# EAGLE design usb_board (EAGLE 9.6.2)
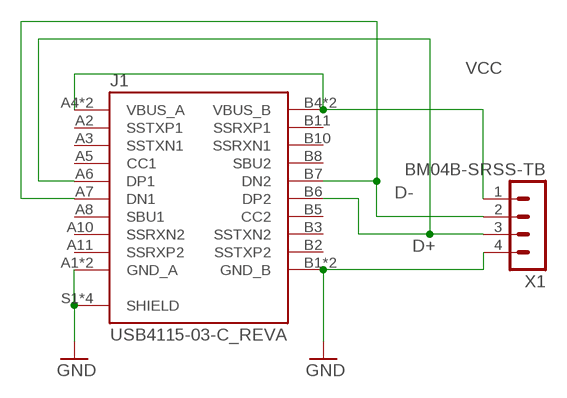
[diagram p0: schematic, sheet 1]

## Parts
J1  USB4115-03-C_REVA  [GCT_USB4115-03-C_REVA]
X1  BM04B-SRSS-TB  [BM04B-SRSS-TB]

## Nets
D+: J1.A6(DP1) J1.B6(DP2) X1.3
D-: J1.A7(DN1) J1.B7(DN2) X1.2
GND: J1.A1(GND_A) J1.A12(GND_A) J1.B1(GND_B) J1.B12(GND_B) J1.S1(SHIELD) J1.S2(SHIELD) J1.S3(SHIELD) J1.S4(SHIELD) X1.4
VCC: J1.A4(VBUS_A) J1.A9(VBUS_A) J1.B4(VBUS_B) J1.B9(VBUS_B) X1.1
Unconnected: J1.A2(SSTXP1) J1.A3(SSTXN1) J1.A5(CC1) J1.A8(SBU1) J1.A10(SSRXN2) J1.A11(SSRXP2) J1.B2(SSTXP2) J1.B3(SSTXN2) J1.B5(CC2) J1.B8(SBU2) J1.B10(SSRXN1) J1.B11(SSRXP1)

## Library data of the parts
J1 = USB4115-03-C_REVA:USB4115-03-C_REVA: Check prices <https://pricing.snapeda.com/parts/USB4115-03-C/Global%20Connector%20Technology/view-part?ref=eda>; AVAILABILITY: In Stock; DESCRIPTION: USB 3.1 Connector Type C Vertical Receptacle, 9.25mm profile, 24 Pins, Surface mount, Top mount, low cost; MF: Global Connector Technology; MP: USB4115-03-C; PACKAGE: None; PRICE: None
X1 = con-JST SH:BM04B-SRSS: JST SH series header 1.00mm pitch disconnectable crimp style connectors, vertical (side entry type), 4 pins

## Board
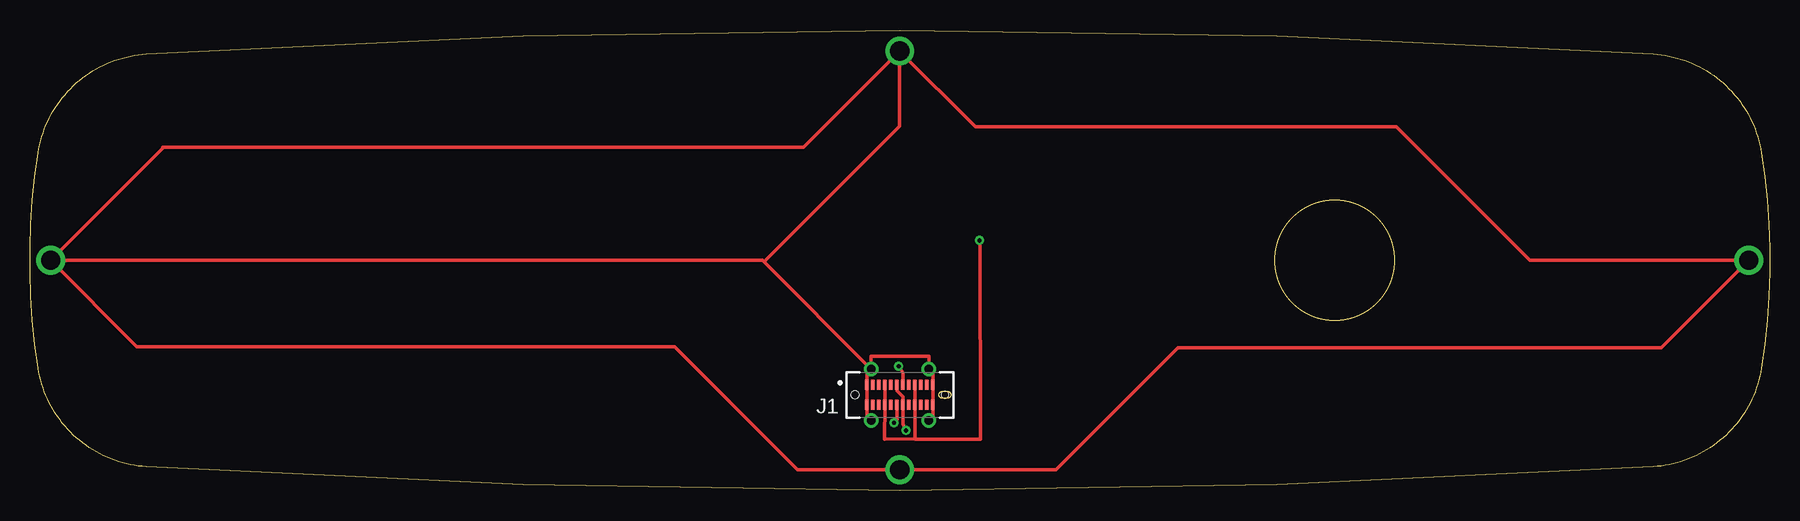
[diagram p1: board, top side]
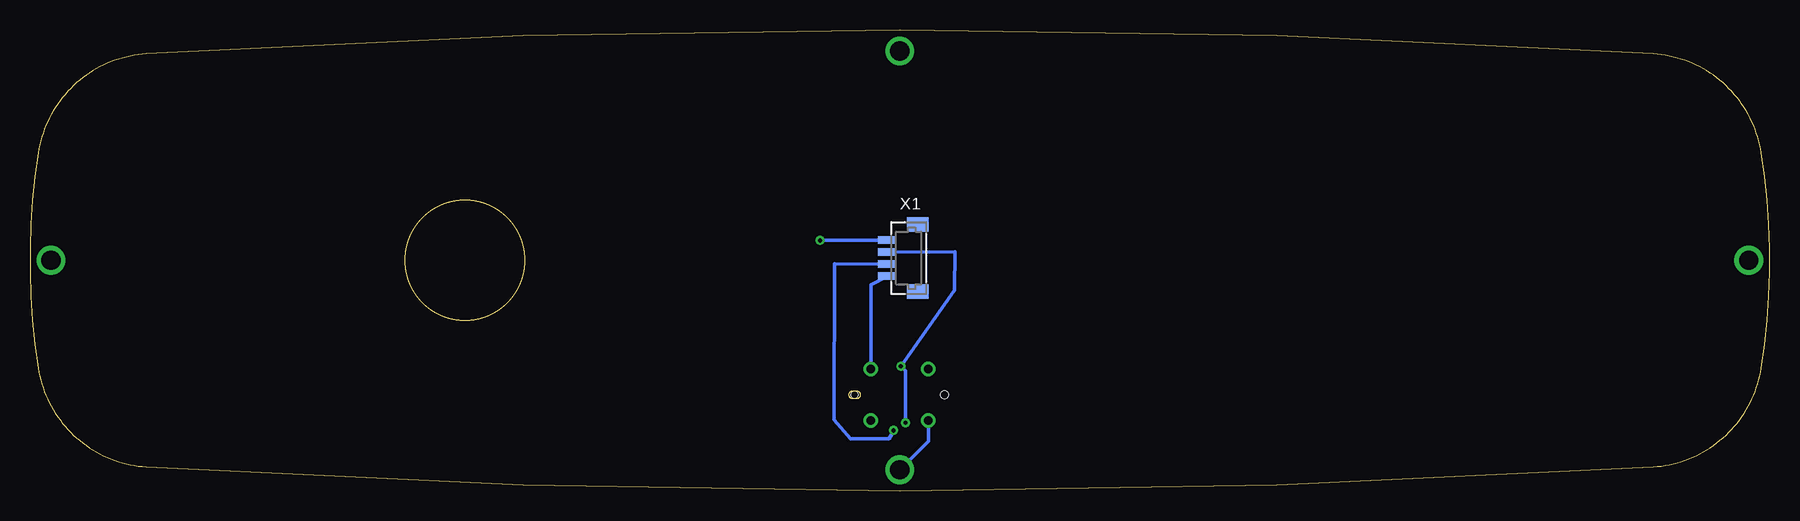
[diagram p2: board, bottom side, seen from below]

Size 145 x 38.4 mm. Coordinates in mm from the lower left corner, seen from the top.
Outline: 135.3,36.4 135.64,36.37 135.97,36.34 136.31,36.28 136.64,36.22 136.97,36.15 137.3,36.06 137.62,35.97 137.94,35.86 138.26,35.74 138.57,35.61 138.88,35.47 139.18,35.32 139.48,35.16 139.77,34.99 140.06,34.81 140.33,34.62 140.61,34.41 140.87,34.2 141.13,33.99 141.38,33.76 141.62,33.52 141.85,33.28 142.08,33.02 142.29,32.76 142.5,32.5 142.7,32.22 142.89,31.94 143.06,31.65 143.23,31.36 143.39,31.06 143.53,30.75 143.67,30.45 143.8,30.13 143.91,29.81 144.01,29.49 144.11,29.17 144.19,28.84 144.26,28.51 144.31,28.17 144.59,26.19 144.8,24.2 144.93,22.2 145,20.2 145,18.2 144.93,16.2 144.8,14.2 144.59,12.21 144.31,10.23 144.26,9.89 144.19,9.56 144.11,9.23 144.01,8.91 143.91,8.59 143.8,8.27 143.67,7.95 143.53,7.64 143.39,7.34 143.23,7.04 143.06,6.75 142.89,6.46 142.7,6.18 142.5,5.9 142.29,5.64 142.08,5.38 141.85,5.12 141.62,4.88 141.38,4.64 141.13,4.41 140.87,4.19 140.61,3.98 140.33,3.78 140.06,3.59 139.77,3.41 139.48,3.24 139.18,3.08 138.88,2.93 138.57,2.79 138.26,2.66 137.94,2.54 137.62,2.43 137.3,2.34 136.97,2.25 136.64,2.18 136.31,2.11 135.97,2.06 135.64,2.02 135.3,2 103.92,0.5 72.5,0 41.08,0.5 9.7,2 9.36,2.02 9.03,2.06 8.69,2.11 8.36,2.18 8.03,2.25 7.7,2.34 7.38,2.43 7.06,2.54 6.74,2.66 6.43,2.79 6.12,2.93 5.82,3.08 5.52,3.24 5.23,3.41 4.95,3.59 4.67,3.78 4.4,3.98 4.13,4.19 3.87,4.41 3.62,4.64 3.38,4.88 3.15,5.12 2.92,5.38 2.71,5.64 2.5,5.9 2.3,6.18 2.12,6.46 1.94,6.75 1.77,7.04 1.61,7.34 1.47,7.64 1.33,7.95 1.2,8.27 1.09,8.59 0.99,8.91 0.89,9.23 0.81,9.56 0.74,9.89 0.69,10.23 0.41,12.21 0.21,14.2 0.07,16.2 0,18.2 0,20.2 0.07,22.2 0.21,24.2 0.41,26.19 0.69,28.17 0.74,28.51 0.81,28.84 0.89,29.17 0.99,29.49 1.09,29.81 1.2,30.13 1.33,30.45 1.47,30.75 1.61,31.06 1.77,31.36 1.94,31.65 2.12,31.94 2.3,32.22 2.5,32.5 2.71,32.76 2.92,33.02 3.15,33.28 3.38,33.52 3.62,33.76 3.87,33.99 4.13,34.2 4.4,34.41 4.67,34.62 4.95,34.81 5.23,34.99 5.52,35.16 5.82,35.32 6.12,35.47 6.43,35.61 6.74,35.74 7.06,35.86 7.38,35.97 7.7,36.06 8.03,36.15 8.36,36.22 8.69,36.28 9.03,36.34 9.36,36.37 9.7,36.4 41.08,37.9 72.5,38.4 103.92,37.9 135.3,36.4
Outline: circle at 108.76,19.2 radius 5
Copper layers (1*16): Top 0.035mm / dielectric 1.5mm / Bottom 0.035mm
Design rules "default *": minimum track width 12mil, minimum drill 0.35mm, track to track 6mil, track to pad 6mil, pad to pad 6mil, via to via 6mil, smd to smd 6mil, copper to edge 40mil, drill to drill 6mil, minimum pad ring 10mil, minimum via ring 8mil, stop-mask expansion 4mil, vias tented up to drill 0mil, thermal gap 10mil

### Footprints (pad centres in the part's own frame; a part is rotated, then mirrored left to right if it is on the bottom)
GCT_USB4115-03-C_REVA = smd 0.3 x 0.85: A1 -2.75,0.835; A2 -2.25,0.835; A3 -1.75,0.835; A4 -1.25,0.835; A5 -0.75,0.835; A6 -0.25,0.835; A7 0.25,0.835; A8 0.75,0.835; A9 1.25,0.835; A10 1.75,0.835; A11 2.25,0.835; A12 2.75,0.835; B1 2.75,-0.835; B2 2.25,-0.835; B3 1.75,-0.835; B4 1.25,-0.835; B5 0.75,-0.835; B6 0.25,-0.835; B7 -0.25,-0.835; B8 -0.75,-0.835; B9 -1.25,-0.835; B10 -1.75,-0.835; B11 -2.25,-0.835; B12 -2.75,-0.835 | drill 0.7 pad 1.1: S1 -2.4,2.15; S2 -2.4,-2.15; S3 2.4,-2.15; S4 2.4,2.15 | hole 0.66: -3.75,0 | hole 0.58: 3.75,0
BM04B-SRSS-TB = smd 0.6 x 1.55: 1 1.5,0; 2 0.5,0; 3 -0.5,0; 4 -1.5,0 | smd 1.2 x 1.8: M1 2.8,-2.525; M2 -2.8,-2.525

### Placement (x,y rotation side)
J1  72.51,8 0 top
X1  73.53,19.4 90 bottom

### Tracks (layer width: path | path; a pad name or v marks a point on that pad's centre or on a via)
D+  (via drill 0.35)
  Top 0.305: J1.A6 72.27,8.32 72.76,7.83 J1.B6 72.78,5.55 v73.03,5.03
  Bottom 0.305: X1.3 77.95,18.9 77.98,5.9 76.62,4.33 73.41,4.33 73.01,4.95 73.01,5.01 v73.03,5.03
D-  (via drill 0.35)
  Top 0.305: v72.02,5.68 72.26,5.92 J1.B7 | J1.A7 72.76,9.84 v72.41,10.38
  Bottom 0.305: v72.02,5.68 72.02,9.99 v72.41,10.38 67.95,16.71 67.92,19.92 X1.2
GND  (via drill 1.6)
  Top 0.305: J1.S1 70.12,11.21 74.92,11.21 J1.S4 75.22,9.84 75.26,9.69 J1.A12 J1.B1 75.26,6.2 J1.S3 | J1.S2 69.79,6.17 69.76,6.27 J1.B12 J1.A1 69.76,9.73 69.79,9.82 J1.S1 | v1.73,19.2 61.06,19.2 61.18,19.08 | 61.18,19.08 J1.S1 | v72.5,36.65 72.5,30.39 61.18,19.08 | v72.5,36.65 78.82,30.33 113.89,30.33 125.02,19.2 v143.26,19.2 135.97,11.91 95.68,11.91 85.52,1.75 v72.5,1.75 63.99,1.75 53.73,12.02 8.91,12.02 v1.73,19.2 | v1.73,19.2 11.08,28.55 11.08,28.63 64.48,28.63 v72.5,36.65
  Bottom 0.305: X1.4 74.88,17.17 J1.S4 | v72.5,1.75 70.11,4.14 J1.S2
VCC  (via drill 0.35)
  Top 0.305: J1.A4 J1.B9 71.22,4.31 73.78,4.32 | J1.A9 J1.B4 73.78,4.98 73.78,4.32 | 73.78,4.32 73.78,4.3 79.22,4.3 79.19,20.86 v79.16,20.86
  Bottom 0.305: v79.16,20.86 X1.1